# EAGLE design WS2812B LED Breakout (EAGLE 8.0.0)
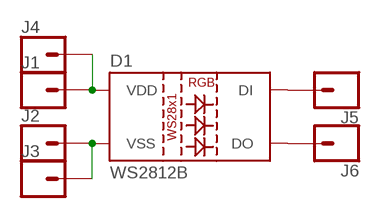
[diagram p0: schematic, sheet 1]

## Parts
D1  WS2812B  [WS2812B]
J1  CONN_01PTH_LONGPAD  [1X01_LONGPAD]
J2  CONN_01PTH_LONGPAD  [1X01_LONGPAD]
J3  CONN_01PTH_LONGPAD  [1X01_LONGPAD]
J4  CONN_01PTH_LONGPAD  [1X01_LONGPAD]
J5  CONN_01PTH_LONGPAD  [1X01_LONGPAD]
J6  CONN_01PTH_LONGPAD  [1X01_LONGPAD]

## Nets
N$1: D1.1(VDD) J1.1 J4.1
N$2: D1.3(VSS) J2.1 J3.1
N$3: D1.4(DI) J5.1
N$4: D1.2(DO) J6.1

## Library data of the parts
D1 = SparkFun-LED:WS2812B: WS2812B SMD addressable RGB LED 5x5mm SMD LED with built-in controller IC. Color: Red/Green/Blue mC Rating: RGB: 390, 660, 180 mcd Forward Voltage: RGB: 2.0, 3.0, 3.0 V Packages:WS2812B SparkFun Products: Blynk Board - ESP8266 <https://www.sparkfun.com/products/13794>; PROD_ID: DIO-12503
J1-J6 = SparkFun-Connectors:CONN_01: Single connection point. Often used as Generic Header-pin footprint for 0.1 inch spaced/style header connections On any of the 0.1 inch spaced packages, you can populate with these: Break Away Headers - Straight <https://www.sparkfun.com/products/116> (PRT-00116) Break Away Male Headers - Right Angle <https://www.sparkfun.com/products/553> (PRT-00553) Female Headers <https://www.sparkfun.com/products/115> (PRT-00115) Break Away Headers - Machine Pin <https://www.sparkfun.com/products/117> (PRT-00117) Break Away Female Headers - Swiss Machine Pin <https://www.sparkfun.com/products/743> (PRT-00743) This device is also useful as a general connection point to wire up your design to another part of your project. Our various solder wires solder well into these plated through hole pads. Hook-Up Wire - Assortment (Stranded, 22 AWG) <https://www.sparkfun.com/products/11375> (PRT-11375) Hook-Up Wire - Assortment (Solid Core, 22 AWG) <https://www.sparkfun.com/products/11367> (PRT-11367) View the entire wire category on our website here <https://www.sparkfun.com/categories/141> Special notes: SMTSO-256-ET is a "flush mount" nut for a 4-40 screw. We mostly use this on specialty testbeds; it is a nice way to connect hardware to your PCB at an adjustable hieght. Also note, the SNAP packages are for using a snappable style connector. We sell a baggie of snaps and they are also used on two LilyPad designs: Snap Assortment - 30 pack (male and female) <https://www.sparkfun.com/products/11347> (DEV-11347) LilyPad Arduino SimpleSnap <https://www.sparkfun.com/products/10941> (DEV-10941) LilyPad SimpleSnap Protoboard <https://www.sparkfun.com/products/10940> (DEV-10940)

## Board
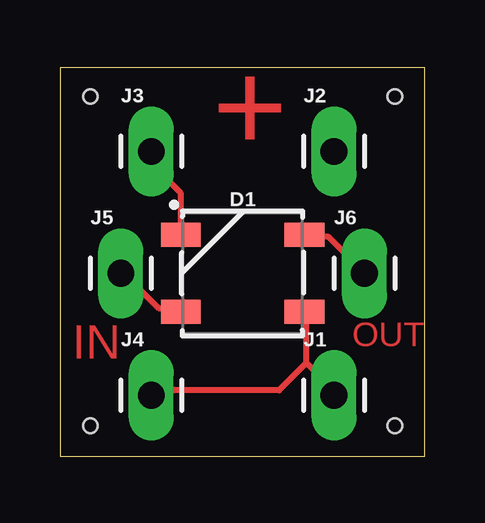
[diagram p1: board, top side]
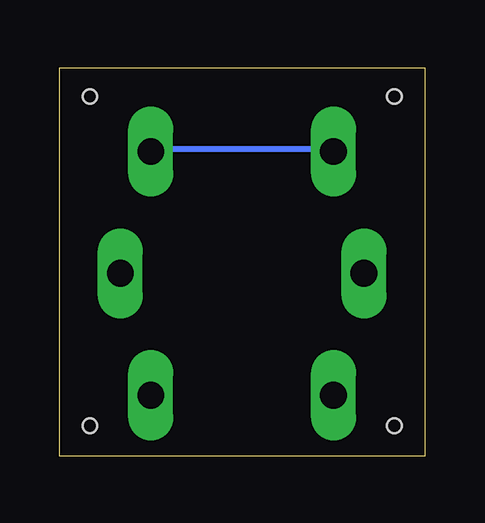
[diagram p2: board, bottom side, seen from below]

Size 15.22 x 16.18 mm. Coordinates in mm from the lower left corner, seen from the top.
Outline: 0,0 15.22,0 15.22,16.18 0,16.18 0,0
Copper layers (1*16): Top 0.035mm / dielectric 1.5mm / Bottom 0.035mm
Design rules "default": minimum track width 10mil, minimum drill 24mil, track to track 8mil, track to pad 8mil, pad to pad 8mil, via to via 8mil, smd to smd 8mil, copper to edge 40mil, drill to drill 8mil, minimum pad ring 10mil, minimum via ring 8mil, stop-mask expansion 4mil, vias tented up to drill 0mil, thermal gap 10mil
Holes 0.6 mm at 1.27,14.99 13.97,14.99 13.97,1.27 1.27,1.27

### Footprints (pad centres in the part's own frame; a part is rotated, then mirrored left to right if it is on the bottom)
WS2812B = smd 1.651 x 1: 1 2.577,-1.6; 2 2.577,1.6; 3 -2.577,1.6; 4 -2.577,-1.6
1X01_LONGPAD = drill 1.118 pad 1.88 long: 1 0,0

### Placement (x,y rotation side)
D1  7.62,7.62 0 top
J1  11.43,2.54 0 top
J2  11.43,12.7 0 top
J3  3.81,12.7 0 top
J4  3.81,2.54 0 top
J5  2.54,7.62 0 top
J6  12.7,7.62 0 top

### Tracks (layer width: path | path; a pad name or v marks a point on that pad's centre or on a via)
N$1
  Top 0.254: 10.29,3.89 10.29,5.94 D1.1 | 10.29,3.89 11.43,2.74 J1.1 | 10.29,3.89 9.14,2.74 3.89,2.74 J4.1
N$2
  Top 0.254: D1.3 5.03,9.37 5.03,10.97 3.89,12.12 3.89,12.57 J3.1
  Bottom 0.254: J2.1 11.43,12.8 3.89,12.8 J3.1
N$3
  Top 0.254: D1.4 5.03,6.17 4.12,6.17 2.74,7.54 J5.1
N$4
  Top 0.254: D1.2 10.29,9.14 11.2,9.14 12.57,7.77 J6.1

### Text on the board
Top: + | OUT | IN